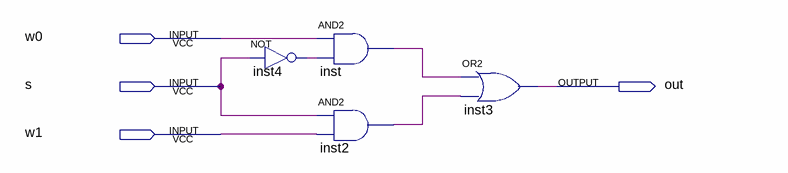
[diagram p0: schematic sheet]
// Quartus schematic mux_2_1.bdf as structural Verilog: 4 symbols, 4 pins
module mux_2_1 (
  input  w0,
  input  s,
  input  w1,
  output out
);

  wire inst2_out, inst4_out, inst_out;

  not inst4 (inst4_out, s);
  and inst (inst_out, w0, inst4_out);
  and inst2 (inst2_out, s, w1);
  or inst3 (out, inst_out, inst2_out);
endmodule
